# EAGLE design power-supply (EAGLE 8.0.2)
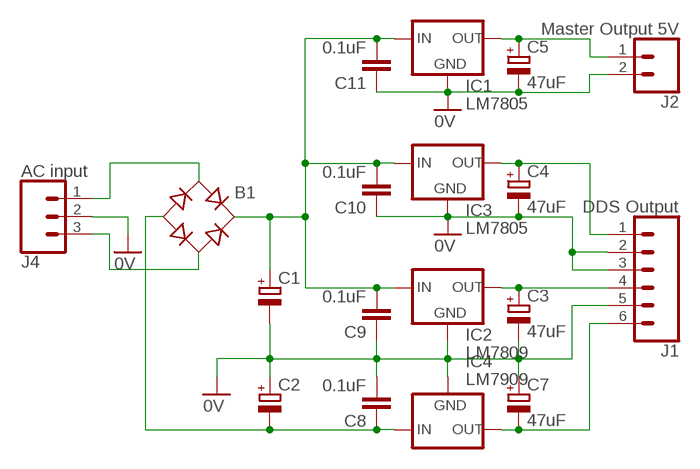
[diagram p0: schematic, sheet 1]

## Parts
B1  RB1A  [RB1A]
C1  CPOL-EUE7.5-16  [E7,5-16]
C2  CPOL-EUE7.5-16  [E7,5-16]
C3  47uF  CPOL-EUE5-6  [E5-6]
C4  47uF  CPOL-EUE5-6  [E5-6]
C5  47uF  CPOL-EUE2.5-6  [E2,5-6]
C7  47uF  CPOL-EUE5-6  [E5-6]
C8  0.1uF  C-EU025-025X050  [C025-025X050]
C9  0.1uF  C-EU025-025X050  [C025-025X050]
C10  0.1uF  C-EU025-025X050  [C025-025X050]
C11  0.1uF  C-EU025-025X050  [C025-025X050]
IC1  LM7805  78XXS  [78XXS]
IC2  LM7809  78XXS  [78XXS]
IC3  LM7805  78XXS  [78XXS]
IC4  LM7909  79XXS  [79XXS]
J1  DDS Output  CONN_06POLAR  [MOLEX-1X6]
J2  Master Output 5V  CONN_02POLAR  [MOLEX-1X2]
J4  AC input  CONN_03POLAR  [MOLEX-1X3]

## Nets
0V: C1.- C2.+ C3.- C4.- C5.- C7.+ C8.2 C9.1 C10.1 C11.1 IC1.GND IC2.GND IC3.GND IC4.GND J1.2 J1.3 J1.5 J2.2 J4.2
5V-DDS: C4.+ IC3.OUT J1.1
5V-MASTER: C5.+ IC1.OUT J2.1
9V: C3.+ IC2.OUT J1.4
-9V: C7.- IC4.OUT J1.6
N$1: B1.+ C1.+ C9.2 C10.2 C11.2 IC1.IN IC2.IN IC3.IN
N$5: B1.- C2.- C8.1 IC4.IN
N$15: B1.AC2 J4.3
N$16: B1.AC1 J4.1

## Library data of the parts
B1 = rectifier:RB1A: RECTIFIER 1 A
C1-C5 C7 = rcl:CPOL-EU: POLARIZED CAPACITOR, European symbol
C8-C11 = rcl:C-EU: CAPACITOR, European symbol
IC1-IC3 = v-reg:78XXS: VOLTAGE REGULATOR
IC4 = v-reg:79XXS: VOLTAGE REGULATOR
J1 = SparkFun-Connectors:CONN_06: Multi connection point. Often used as Generic Header-pin footprint for 0.1 inch spaced/style header connections On any of the 0.1 inch spaced packages, you can populate with these: Break Away Headers - Straight <https://www.sparkfun.com/products/116> (PRT-00116) Break Away Male Headers - Right Angle <https://www.sparkfun.com/products/553> (PRT-00553) Female Headers <https://www.sparkfun.com/products/115> (PRT-00115) Break Away Headers - Machine Pin <https://www.sparkfun.com/products/117> (PRT-00117) Break Away Female Headers - Swiss Machine Pin <https://www.sparkfun.com/products/743> (PRT-00743) Arduino Stackable Header - 6 Pin <https://www.sparkfun.com/products/9280> (PRT-09280) For SCREWTERMINALS and SPRING TERMINALS visit here: Screw Terimnals on SparkFun.com <https://www.sparkfun.com/search/results?term=Screw+Terminals> (5mm/3.5mm/2.54mm spacing) This device is also useful as a general connection point to wire up your design to another part of your project. Our various solder wires solder well into these plated through hole pads. Hook-Up Wire - Assortment (Stranded, 22 AWG) <https://www.sparkfun.com/products/11375> (PRT-11375) Hook-Up Wire - Assortment (Solid Core, 22 AWG) <https://www.sparkfun.com/products/11367> (PRT-11367) View the entire wire category on our website here <https://www.sparkfun.com/categories/141>
J2 = SparkFun-Connectors:CONN_02: Multi connection point. Often used as Generic Header-pin footprint for 0.1 inch spaced/style header connections On any of the 0.1 inch spaced packages, you can populate with these: Break Away Headers - Straight <https://www.sparkfun.com/products/116> (PRT-00116) Break Away Male Headers - Right Angle <https://www.sparkfun.com/products/553> (PRT-00553) Female Headers <https://www.sparkfun.com/products/115> (PRT-00115) Break Away Headers - Machine Pin <https://www.sparkfun.com/products/117> (PRT-00117) Break Away Female Headers - Swiss Machine Pin <https://www.sparkfun.com/products/743> (PRT-00743) For SCREWTERMINALS and SPRING TERMINALS visit here: Screw Terimnals on SparkFun.com <https://www.sparkfun.com/search/results?term=Screw+Terminals> (5mm/3.5mm/2.54mm spacing) This device is also useful as a general connection point to wire up your design to another part of your project. Our various solder wires solder well into these plated through hole pads. Hook-Up Wire - Assortment (Stranded, 22 AWG) <https://www.sparkfun.com/products/11375> (PRT-11375) Hook-Up Wire - Assortment (Solid Core, 22 AWG) <https://www.sparkfun.com/products/11367> (PRT-11367) View the entire wire category on our website here <https://www.sparkfun.com/categories/141> Special notes: Molex polarized connector foot print use with: PRT-08233 with associated crimp pins and housings. 2.54_SCREWTERM for use with PRT-10571. 3.5mm Screw Terminal footprints for PRT-08084 5mm Screw Terminal footprints for use with PRT-08432; SF_ID: PRT-09918
J4 = SparkFun-Connectors:CONN_03: Multi connection point. Often used as Generic Header-pin footprint for 0.1 inch spaced/style header connections On any of the 0.1 inch spaced packages, you can populate with these: Break Away Headers - Straight <https://www.sparkfun.com/products/116> (PRT-00116) Break Away Male Headers - Right Angle <https://www.sparkfun.com/products/553> (PRT-00553) Female Headers <https://www.sparkfun.com/products/115> (PRT-00115) Break Away Headers - Machine Pin <https://www.sparkfun.com/products/117> (PRT-00117) Break Away Female Headers - Swiss Machine Pin <https://www.sparkfun.com/products/743> (PRT-00743) Stackable Header - 3 Pin (Female, 0.1") <https://www.sparkfun.com/products/13875> (PRT-13875) For SCREWTERMINALS and SPRING TERMINALS visit here: Screw Terimnals on SparkFun.com <https://www.sparkfun.com/search/results?term=Screw+Terminals> (5mm/3.5mm/2.54mm spacing) This device is also useful as a general connection point to wire up your design to another part of your project. Our various solder wires solder well into these plated through hole pads. Hook-Up Wire - Assortment (Stranded, 22 AWG) <https://www.sparkfun.com/products/11375> (PRT-11375) Hook-Up Wire - Assortment (Solid Core, 22 AWG) <https://www.sparkfun.com/products/11367> (PRT-11367) View the entire wire category on our website here <https://www.sparkfun.com/categories/141> Special notes: Molex polarized connector foot print use with SKU : PRT-08232 with associated crimp pins and housings.; PROD_ID: CONN-08625; SF_ID: PRT-08096

## Board
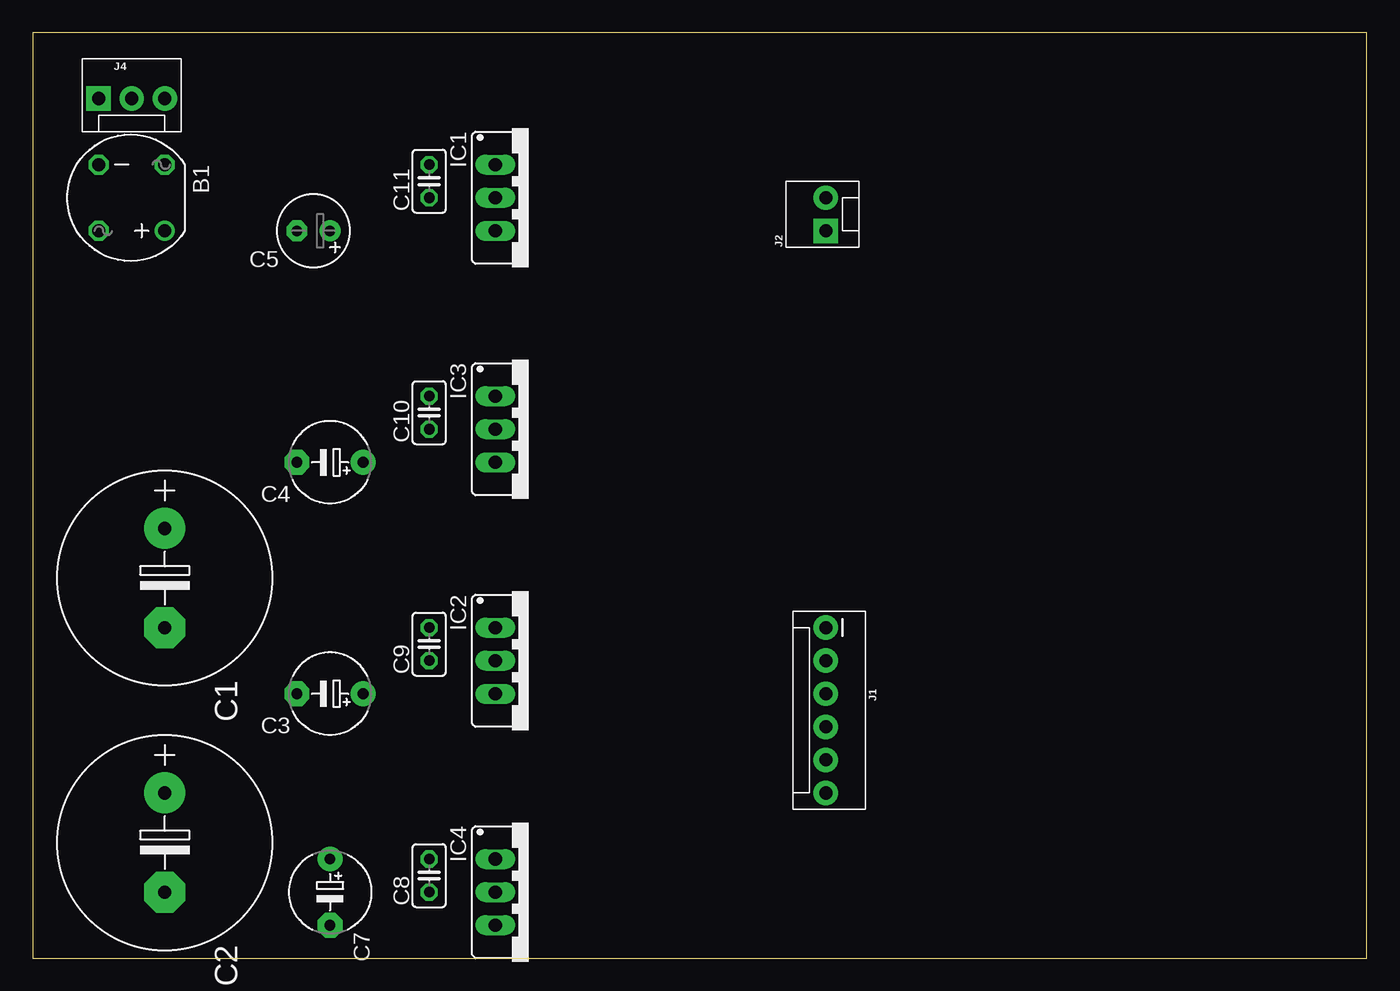
[diagram p1: board, top side]
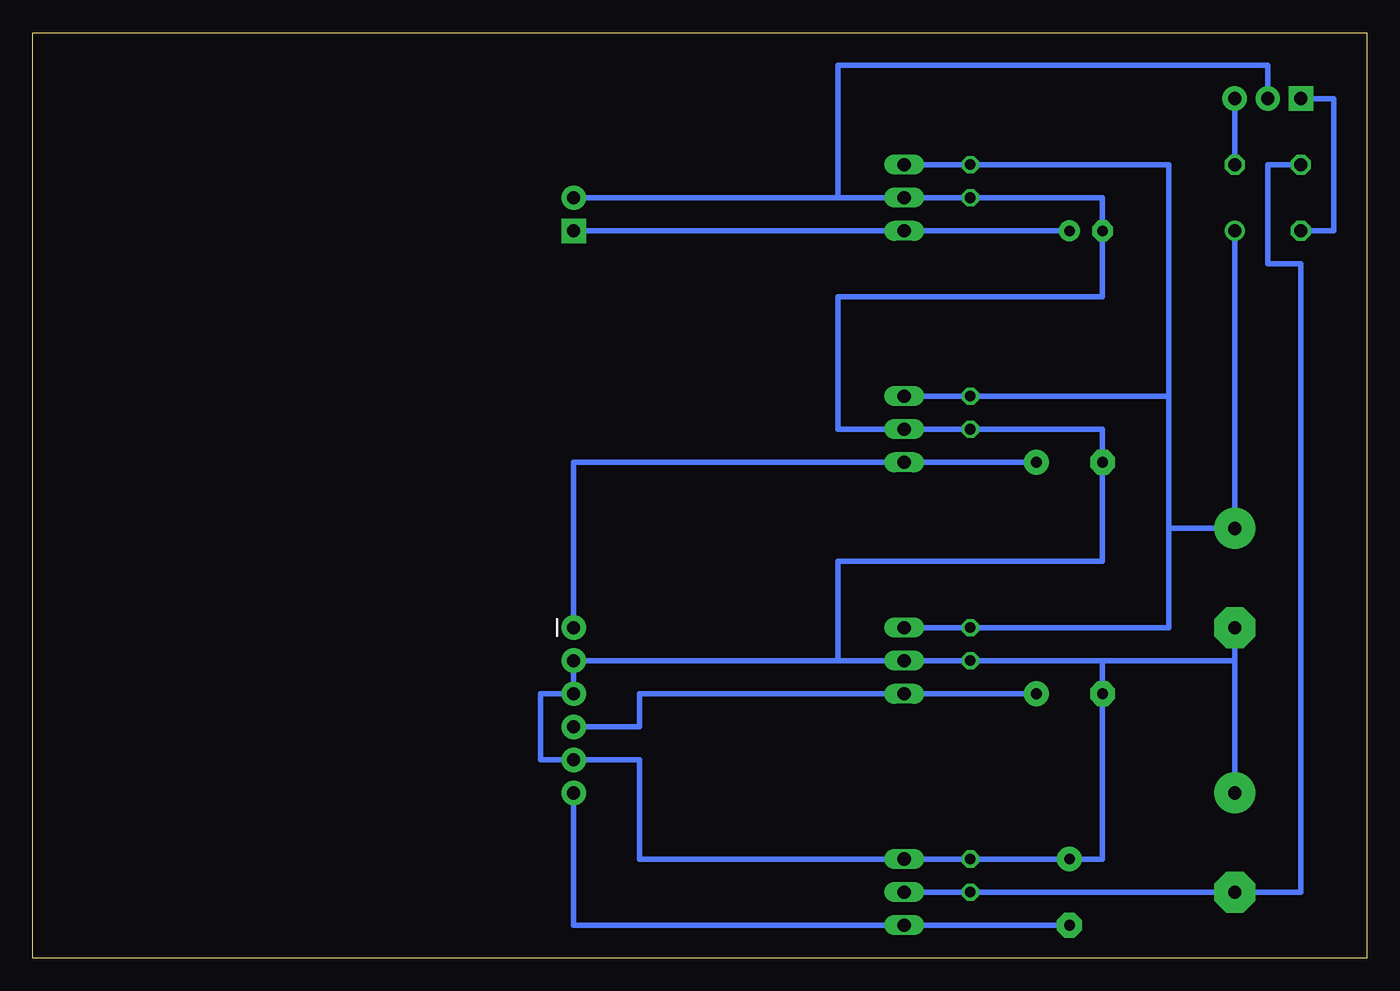
[diagram p2: board, bottom side, seen from below]

Size 102.54 x 71.11 mm. Coordinates in mm from the lower left corner, seen from the top.
Outline: 0,0 102.54,0 102.54,71.11 0,71.11 0,0
Copper layers (1*16): Top 0.035mm / dielectric 1.5mm / Bottom 0.035mm
Design rules "default": minimum track width 10mil, minimum drill 24mil, track to track 8mil, track to pad 8mil, pad to pad 8mil, via to via 8mil, smd to smd 8mil, copper to edge 40mil, drill to drill 8mil, minimum pad ring 10mil, minimum via ring 8mil, stop-mask expansion 4mil, vias tented up to drill 0mil, thermal gap 10mil

### Footprints (pad centres in the part's own frame; a part is rotated, then mirrored left to right if it is on the bottom)
RB1A = drill 1.016: + -2.54,2.54 | drill 1.016 octagon: - 2.54,-2.54; AC1 2.54,2.54; AC2 -2.54,-2.54
E7,5-16 = drill 1.016 pad 3.15: + -3.81,0 | drill 1.016 pad 3.15 octagon: - 3.81,0
E5-6 = drill 0.813 pad 1.905: + -2.54,0 | drill 0.813 pad 1.905 octagon: - 2.54,0
E2,5-6 = drill 0.813 pad 1.6: + -1.27,0 | drill 0.813 pad 1.6 octagon: - 1.27,0
C025-025X050 = drill 0.813 octagon: 1 -1.27,0; 2 1.27,0
78XXS = drill 1.016 long: GND 0,-2.54; IN -2.54,-2.54; OUT 2.54,-2.54
79XXS = drill 1.016 long: GND -2.54,-2.54; IN 0,-2.54; OUT 2.54,-2.54
MOLEX-1X6 = drill 1.016 pad 1.88: 1 0,0; 2 2.54,0; 3 5.08,0; 4 7.62,0; 5 10.16,0; 6 12.7,0
MOLEX-1X2 = drill 1.016 pad 1.88 square: 1 0,0 | drill 1.016 pad 1.88: 2 2.54,0
MOLEX-1X3 = drill 1.016 pad 1.88 square: 1 0,0 | drill 1.016 pad 1.88: 2 2.54,0; 3 5.08,0

### Placement (x,y rotation side)
B1  7.62,58.42 180 top
C1  10.16,29.21 270 top
C2  10.16,8.89 270 top
C3  22.86,20.32 180 top
C4  22.86,38.1 180 top
C5  21.59,55.88 180 top
C7  22.86,5.08 270 top
C8  30.48,6.35 90 top
C9  30.48,24.13 90 top
C10  30.48,41.91 90 top
C11  30.48,59.69 90 top
IC1  38.1,58.42 270 top
IC2  38.1,22.86 270 top
IC3  38.1,40.64 270 top
IC4  38.1,5.08 270 top
J1  60.96,25.4 270 top
J2  60.96,55.88 90 top
J4  5.08,66.04 0 top

### Tracks (layer width: path | path; a pad name or v marks a point on that pad's centre or on a via)
0V
  Bottom 0.406: IC1.GND C11.1 | C11.1 20.32,58.42 C5.- 20.32,50.8 40.64,50.8 40.64,40.64 IC3.GND C10.1 20.32,40.64 C4.- 20.32,30.48 40.64,30.48 40.64,22.86 | 40.64,58.42 J2.2 | 40.64,58.42 C11.1 | J4.2 7.62,68.58 40.64,68.58 40.64,58.42 | 40.64,22.86 IC2.GND C9.1 20.32,22.86 | 20.32,22.86 C3.- 20.32,7.62 C7.+ C8.2 IC4.GND 55.88,7.62 55.88,15.24 J1.5 63.5,15.24 63.5,20.32 J1.3 J1.2 40.64,22.86 | C1.- 10.16,22.86 | 10.16,22.86 C2.+ | 10.16,22.86 20.32,22.86
5V-DDS
  Bottom 0.406: C4.+ IC3.OUT 60.96,38.1 J1.1
5V-MASTER
  Bottom 0.406: IC1.OUT C5.+ J2.1
9V
  Bottom 0.406: C3.+ IC2.OUT 55.88,20.32 55.88,17.78 J1.4
-9V
  Bottom 0.406: C7.- IC4.OUT 60.96,2.54 J1.6
N$1
  Bottom 0.406: 15.24,43.18 15.24,60.96 C11.2 IC1.IN | 15.24,43.18 C10.2 IC3.IN | IC2.IN C9.2 15.24,25.4 15.24,33.02 | C1.+ 10.16,43.18 | B1.+ C1.+ | 15.24,33.02 C1.+ | 15.24,33.02 15.24,43.18
N$5
  Bottom 0.406: IC4.IN C8.1 C2.- 5.08,5.08 5.08,53.34 7.62,53.34 7.62,60.96 B1.-
N$15
  Bottom 0.406: J4.3 B1.AC2
N$16
  Bottom 0.406: J4.1 2.54,66.04 2.54,55.88 B1.AC1